# EAGLE design mainNarrow (EAGLE 9.3.1)
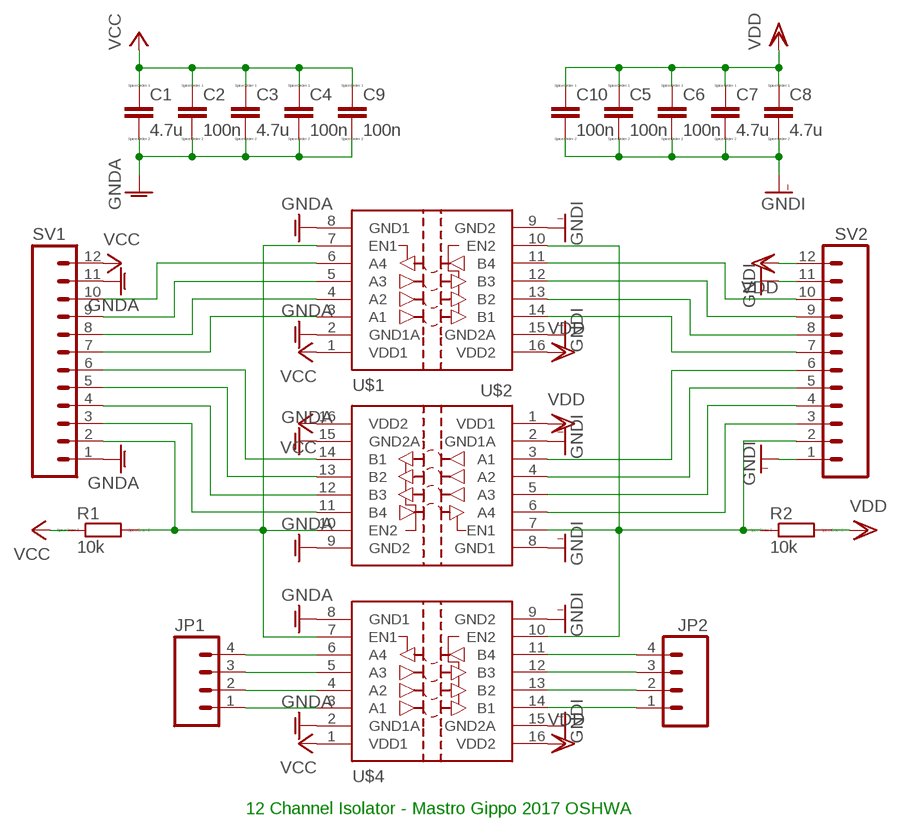
[diagram p0: schematic, sheet 1]

## Parts
C1  4.7u  C-EUC0805K  [C0805K]
C2  100n  C-EUC0805K  [C0805K]
C3  4.7u  C-EUC0805K  [C0805K]
C4  100n  C-EUC0805K  [C0805K]
C5  100n  C-EUC0805K  [C0805K]
C6  100n  C-EUC0805K  [C0805K]
C7  4.7u  C-EUC0805K  [C0805K]
C8  4.7u  C-EUC0805K  [C0805K]
C9  100n  C-EUC0805K  [C0805K]
C10  100n  C-EUC0805K  [C0805K]
JP1  M04LONGPADS  [1X04_LONGPADS]
JP2  M04LONGPADS  [1X04_LONGPADS]
R1  10k  R-EU_M0805  [M0805]
R2  10k  R-EU_M0805  [M0805]
SV1  M12LONGPADS  [1X12_LONGPADS]
SV2  M12LONGPADS  [1X12_LONGPADS]
U$1  SI8441IS1  [SO16]
U$2  SI8441IS1  [SO16]
U$4  SI8441IS1  [SO16]

## Nets
GNDA: C1.2 C2.2 C3.2 C4.2 C9.2 SV1.1 SV1.11 U$1.2(GND1A) U$1.8(GND1) U$2.9(GND2) U$2.15(GND2A) U$4.2(GND1A) U$4.8(GND1)
GNDI: C5.2 C6.2 C7.2 C8.2 C10.2 SV2.1 SV2.11 U$1.9(GND2) U$1.15(GND2A) U$2.2(GND1A) U$2.8(GND1) U$4.9(GND2) U$4.15(GND2A)
N$1: SV1.10 U$1.6(A4)
N$2: SV1.9 U$1.5(A3)
N$3: SV1.8 U$1.4(A2)
N$4: SV1.7 U$1.3(A1)
N$5: R1.2 SV1.2 U$1.7(EN1) U$2.10(EN2) U$4.7(EN1)
N$6: R2.1 SV2.2 U$1.10(EN2) U$2.7(EN1) U$4.10(EN2)
N$7: SV1.6 U$2.14(B1)
N$8: SV1.5 U$2.13(B2)
N$9: SV1.4 U$2.12(B3)
N$10: SV1.3 U$2.11(B4)
N$11: SV2.9 U$1.12(B3)
N$12: SV2.8 U$1.13(B2)
N$13: SV2.10 U$1.11(B4)
N$14: SV2.7 U$1.14(B1)
N$15: SV2.6 U$2.3(A1)
N$16: SV2.5 U$2.4(A2)
N$17: SV2.4 U$2.5(A3)
N$18: SV2.3 U$2.6(A4)
N$19: JP1.1 U$4.3(A1)
N$20: JP1.2 U$4.4(A2)
N$21: JP1.3 U$4.5(A3)
N$22: JP1.4 U$4.6(A4)
N$23: JP2.1 U$4.14(B1)
N$24: JP2.2 U$4.13(B2)
N$25: JP2.3 U$4.12(B3)
N$26: JP2.4 U$4.11(B4)
VCC: C1.1 C2.1 C3.1 C4.1 C9.1 R1.1 SV1.12 U$1.1(VDD1) U$2.16(VDD2) U$4.1(VDD1)
VDD: C5.1 C6.1 C7.1 C8.1 C10.1 R2.2 SV2.12 U$1.16(VDD2) U$2.1(VDD1) U$4.16(VDD2)

## Notes on the sheet
- 12 Channel Isolator - Mastro Gippo 2017 OSHWA

## Library data of the parts
C1-C10 = resistor:C-EU: CAPACITOR, European symbol; SPICEPREFIX: C
JP1 JP2 = SparkFun-Connectors:M04: Header 4 Standard 4-pin 0.1" header. Use with straight break away headers (SKU : PRT-00116), right angle break away headers (PRT-00553), swiss pins (PRT-00743), machine pins (PRT-00117), and female headers (PRT-00115). Molex polarized connector foot print use with SKU : PRT-08231 with associated crimp pins and housings. 1MM SMD Version SKU: PRT-10208
R1 R2 = resistor:R-EU_: RESISTOR, European symbol; SPICEPREFIX: R
SV1 SV2 = SparkFun-Connectors:M12: Header 12 Standard 12-pin 0.1" header. Use with straight break away headers (SKU : PRT-00116), right angle break away headers (PRT-00553), swiss pins (PRT-00743), machine pins (PRT-00117), and female headers (PRT-00115).
U$1 U$2 U$4 = silicon-labs:SI8441: Si8441 4 Channel (3/1) Digital Isolator Silicon Labs Si84xx ISOpro digital isolator series. The Si84xx ISOpro digital isolators provide low power galvanic isolation for digital signals. The '41 has three forward and one reverse channel, with output enables. This part is suitable for four wire SPI: unidirectional signals with clock and chip select. They come in speeds of 1Mbps and 150Mbps, and isolation ratings of 1KV, 2.5KV and 5KV. The independent sides use 2.7-5.5V supplies and draw under 5mA per channel. Donald Becker

## Board
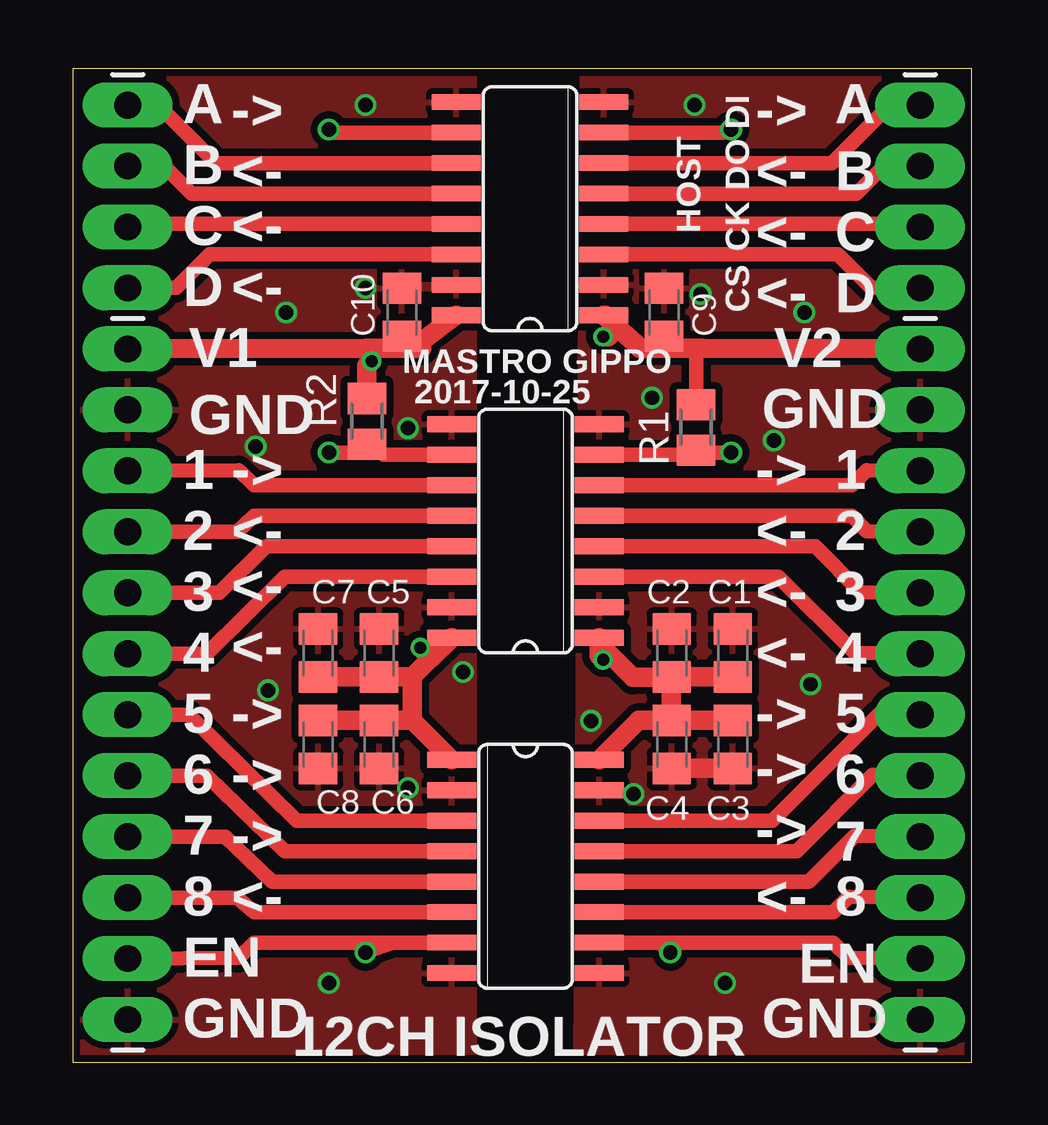
[diagram p1: board, top side]
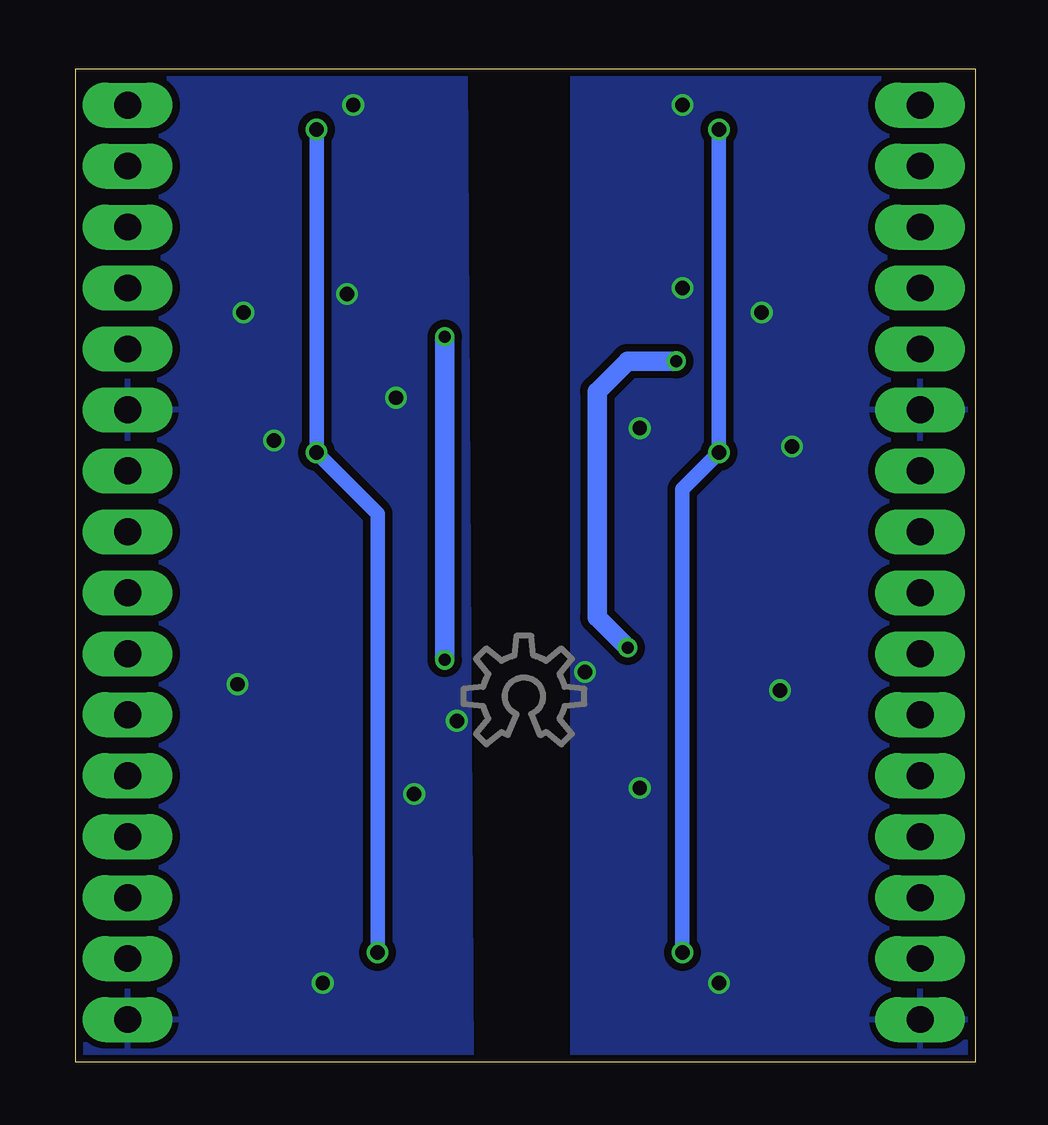
[diagram p2: board, bottom side, seen from below]

Size 37.46 x 41.4 mm. Coordinates in mm from the lower left corner, seen from the top.
Outline: 0,0 37.46,0 37.46,41.4 0,41.4 0,0
Copper layers (1*16): Top 0.035mm / dielectric 1.5mm / Bottom 0.035mm
Design rules "ITEADstudio_DRC": minimum track width 6mil, minimum drill 12mil, track to track 6mil, track to pad 6mil, pad to pad 6mil, via to via 6mil, smd to smd 0mil, copper to edge 10mil, drill to drill 10mil, minimum pad ring 10mil, minimum via ring 6mil, stop-mask expansion 2mil, vias tented up to drill 100mil, thermal gap 10mil

### Footprints (pad centres in the part's own frame; a part is rotated, then mirrored left to right if it is on the bottom)
C0805K = smd 1.3 x 1.6: 1 -1,0; 2 1,0
1X04_LONGPADS = drill 1.118 pad 1.88 long: 1 0,0; 2 2.54,0; 3 5.08,0; 4 7.62,0
M0805 = smd 1.3 x 1.6: 1 -0.95,0; 2 0.95,0
1X12_LONGPADS = drill 1.118 pad 1.88 long: 1 0,0; 2 2.54,0; 3 5.08,0; 4 7.62,0; 5 10.16,0; 6 12.7,0; 7 15.24,0; 8 17.78,0; 9 20.32,0; 10 22.86,0; 11 25.4,0; 12 27.94,0
SO16 = smd 0.66 x 2.032: 1 -4.445,-3.073; 2 -3.175,-3.073; 3 -1.905,-3.073; 4 -0.635,-3.073; 5 0.635,-3.073; 6 1.905,-3.073; 7 3.175,-3.073; 8 4.445,-3.073; 9 4.445,3.073; 10 3.175,3.073; 11 1.905,3.073; 12 0.635,3.073; 13 -0.635,3.073; 14 -1.905,3.073; 15 -3.175,3.073; 16 -4.445,3.073

### Placement (x,y rotation side)
C1  27.5,17.05 90 top
C2  24.96,17.05 90 top
C3  27.5,13.24 270 top
C4  24.96,13.24 270 top
C5  12.76,17.05 90 top
C6  12.76,13.24 270 top
C7  10.22,17.05 90 top
C8  10.22,13.24 270 top
C9  24.64,31.24 90 top
C10  13.72,31.24 90 top
JP1  35.31,32.26 90 top
JP2  2.29,32.26 90 top
R1  25.97,26.45 270 top
R2  12.26,26.7 90 top
SV1  35.31,1.78 90 top
SV2  2.29,1.78 90 top
U$1  18.86,22.13 90 top
U$2  18.86,8.16 270 top
U$3  [OSHWLOGO_TOL_0.2]  18.8,15.24 0 bottom
U$4  19.05,35.56 90 top

### Tracks (layer width: path | path; a pad name or v marks a point on that pad's centre or on a via)
GNDA  (via drill 0.6)
  Top 0.813: C4.2 C3.2
  other vias: 29.21,25.91 30.73,15.75 27.18,3.3 21.59,14.22 26.16,32 25.91,39.88 24.13,27.69 30.48,31.24 23.37,11.18
  pour Top (isolate 0.305): 21.24,41.4 37.46,41.4 37.21,0 20.98,0
  pour Bottom (isolate 0.305): 21.24,41.4 37.46,41.4 37.21,0 20.98,0
GNDI  (via drill 0.6)
  other vias: 7.62,25.65 13.97,26.42 8.13,15.49 16.26,16.26 10.67,3.3 12.19,32.26 12.19,39.88 8.89,31.24 13.97,11.43
  pour Top (isolate 0.305): 0.25,41.4 0.25,0 16.73,0 16.73,41.4
  pour Bottom (isolate 0.305): 0.25,41.4 0.25,0 16.73,0 16.73,41.4
N$1
  Top 0.61: U$1.6 32.45,24.04 33.08,24.67 SV1.10
N$2
  Top 0.61: U$1.5 32.45,22.77 33.08,22.13 SV1.9
N$3
  Top 0.61: U$1.4 30.93,21.5 32.83,19.59 SV1.8
N$4
  Top 0.61: U$1.3 29.4,20.23 32.58,17.05 SV1.7
N$5  (via drill 0.6)
  Top 0.61: SV1.2 32.32,4.35 31.69,4.99 U$2.10 24.48,4.99 v24.89,4.57 | U$1.7 25.52,25.3 R1.2 26.32,25.4 v27.43,25.4 | U$4.7 27.05,38.73 v27.43,38.86
  Bottom 0.61: v24.89,4.57 24.89,22.86 v27.43,25.4 v27.43,38.86
N$6  (via drill 0.6)
  Top 0.61: SV2.2 6.92,4.35 7.56,4.99 U$2.7 13.37,4.99 v12.19,4.57 | U$1.10 12.96,25.3 R2.1 11.9,25.4 v10.67,25.4 | U$4.10 10.79,38.73 v10.67,38.86
  Bottom 0.61: v12.19,4.57 12.19,23.88 v10.67,25.4 v10.67,38.86
N$7
  Top 0.61: U$2.14 29.15,10.06 33.59,14.51 SV1.6
N$8
  Top 0.61: U$2.13 30.16,8.79 33.34,11.97 SV1.5
N$9
  Top 0.61: U$2.12 30.67,7.53 32.58,9.43 SV1.4
N$10
  Top 0.61: U$2.11 31.69,6.25 32.32,6.89 SV1.3
N$11
  Top 0.61: U$1.12 7.56,22.77 6.86,22.1 SV2.9
N$12
  Top 0.61: U$1.13 8.06,21.5 6.1,19.56 SV2.8
N$13
  Top 0.61: U$1.11 7.56,24.04 6.92,24.67 SV2.10
N$14
  Top 0.61: U$1.14 8.83,20.23 5.59,17.02 SV2.7
N$15
  Top 0.61: U$2.3 9.34,10.06 4.83,14.48 SV2.6
N$16
  Top 0.61: U$2.4 8.83,8.79 5.59,11.94 SV2.5
N$17
  Top 0.61: U$2.5 8.32,7.53 6.35,9.4 SV2.4
N$18
  Top 0.61: U$2.6 7.56,6.25 6.86,6.86 SV2.3
N$19
  Top 0.61: U$4.3 31.88,33.66 33.27,32.26 JP1.1
N$20
  Top 0.61: U$4.4 35.18,34.92 JP1.2
N$21
  Top 0.61: U$4.5 32.64,36.2 33.78,37.34 JP1.3
N$22
  Top 0.61: U$4.6 31.62,37.47 34.04,39.88 JP1.4
N$23
  Top 0.61: U$4.14 5.71,33.66 4.32,32.26 JP2.1
N$24
  Top 0.61: U$4.13 2.67,34.92 2.54,34.8 JP2.2
N$25
  Top 0.61: U$4.12 4.95,36.2 3.81,37.34 JP2.3
N$26
  Top 0.61: U$4.11 5.97,37.47 3.56,39.88 JP2.4
VCC  (via drill 0.5)
  Top 0.61: R1.1 25.97,29.5 26.23,29.75 | C9.1 24.64,29.75
  Top 0.813: 24.94,14.26 C4.1 C3.1 | SV1.12 26.23,29.75 24.64,29.75 23.62,29.75 23.65,29.78 U$4.1 22.19,31.11 22.69,30.62 22.3,30.23 v22.1,30.23 | 24.94,14.26 24.94,16.03 | 24.94,16.03 C2.1 C1.1 | 24.94,16.03 23.34,16.03 22.1,17.27 22.1,17.52 U$1.1 21.93,16.93 v22.1,16.76 | 24.94,14.26 23.58,14.26 U$2.16
  Bottom 0.813: v22.1,16.76 v22.1,30.23
VDD  (via drill 0.5)
  Top 0.61: R2.2 12.26,29.75 | C10.1 13.72,30 13.97,29.75
  Top 0.813: C7.1 C5.1 14.15,16.05 | C8.1 C6.1 14.15,14.24 | SV2.12 12.26,29.75 13.97,29.75 14.22,29.75 | 14.22,29.75 14.54,29.75 | 14.15,14.24 14.15,16.05 | U$4.16 14.45,29.98 14.22,29.75 | U$1.16 14.93,16.83 | 14.93,16.83 14.15,16.05 | R2.2 12.26,29.02 v12.45,29.21 | v14.48,17.27 14.93,16.83 | 14.15,14.24 U$2.1
  Bottom 0.813: v12.45,29.21 14.48,29.21 15.75,27.94 15.75,18.54 v14.48,17.27

### Text on the board
tNames: A | -> | DI | -> | A | B | <- | DO | <- | B | HOST | C | <- | CK | <- | C | D | <- | CS | <- | D | V1 | MASTRO GIPPO | V2 | 2017-10-25 | GND | GND | 1 | -> | -> | 1 | 2 | <- | <- | 2 | 3 | <- | <- | 3 | <- | 4 | <- | 4 | 5 | -> | -> | 5 | 6 | -> | -> | 6 | 7 | -> | -> | 7 | 8 | <- | <- | 8 | EN | EN | GND | GND | 12CH ISOLATOR